# EAGLE design Adafruit_LSM6DSOX (EAGLE 9.5.1)
COMPANY: ADAFRUIT INDUSTRIES; DRAWN: KTOWN; REV: A
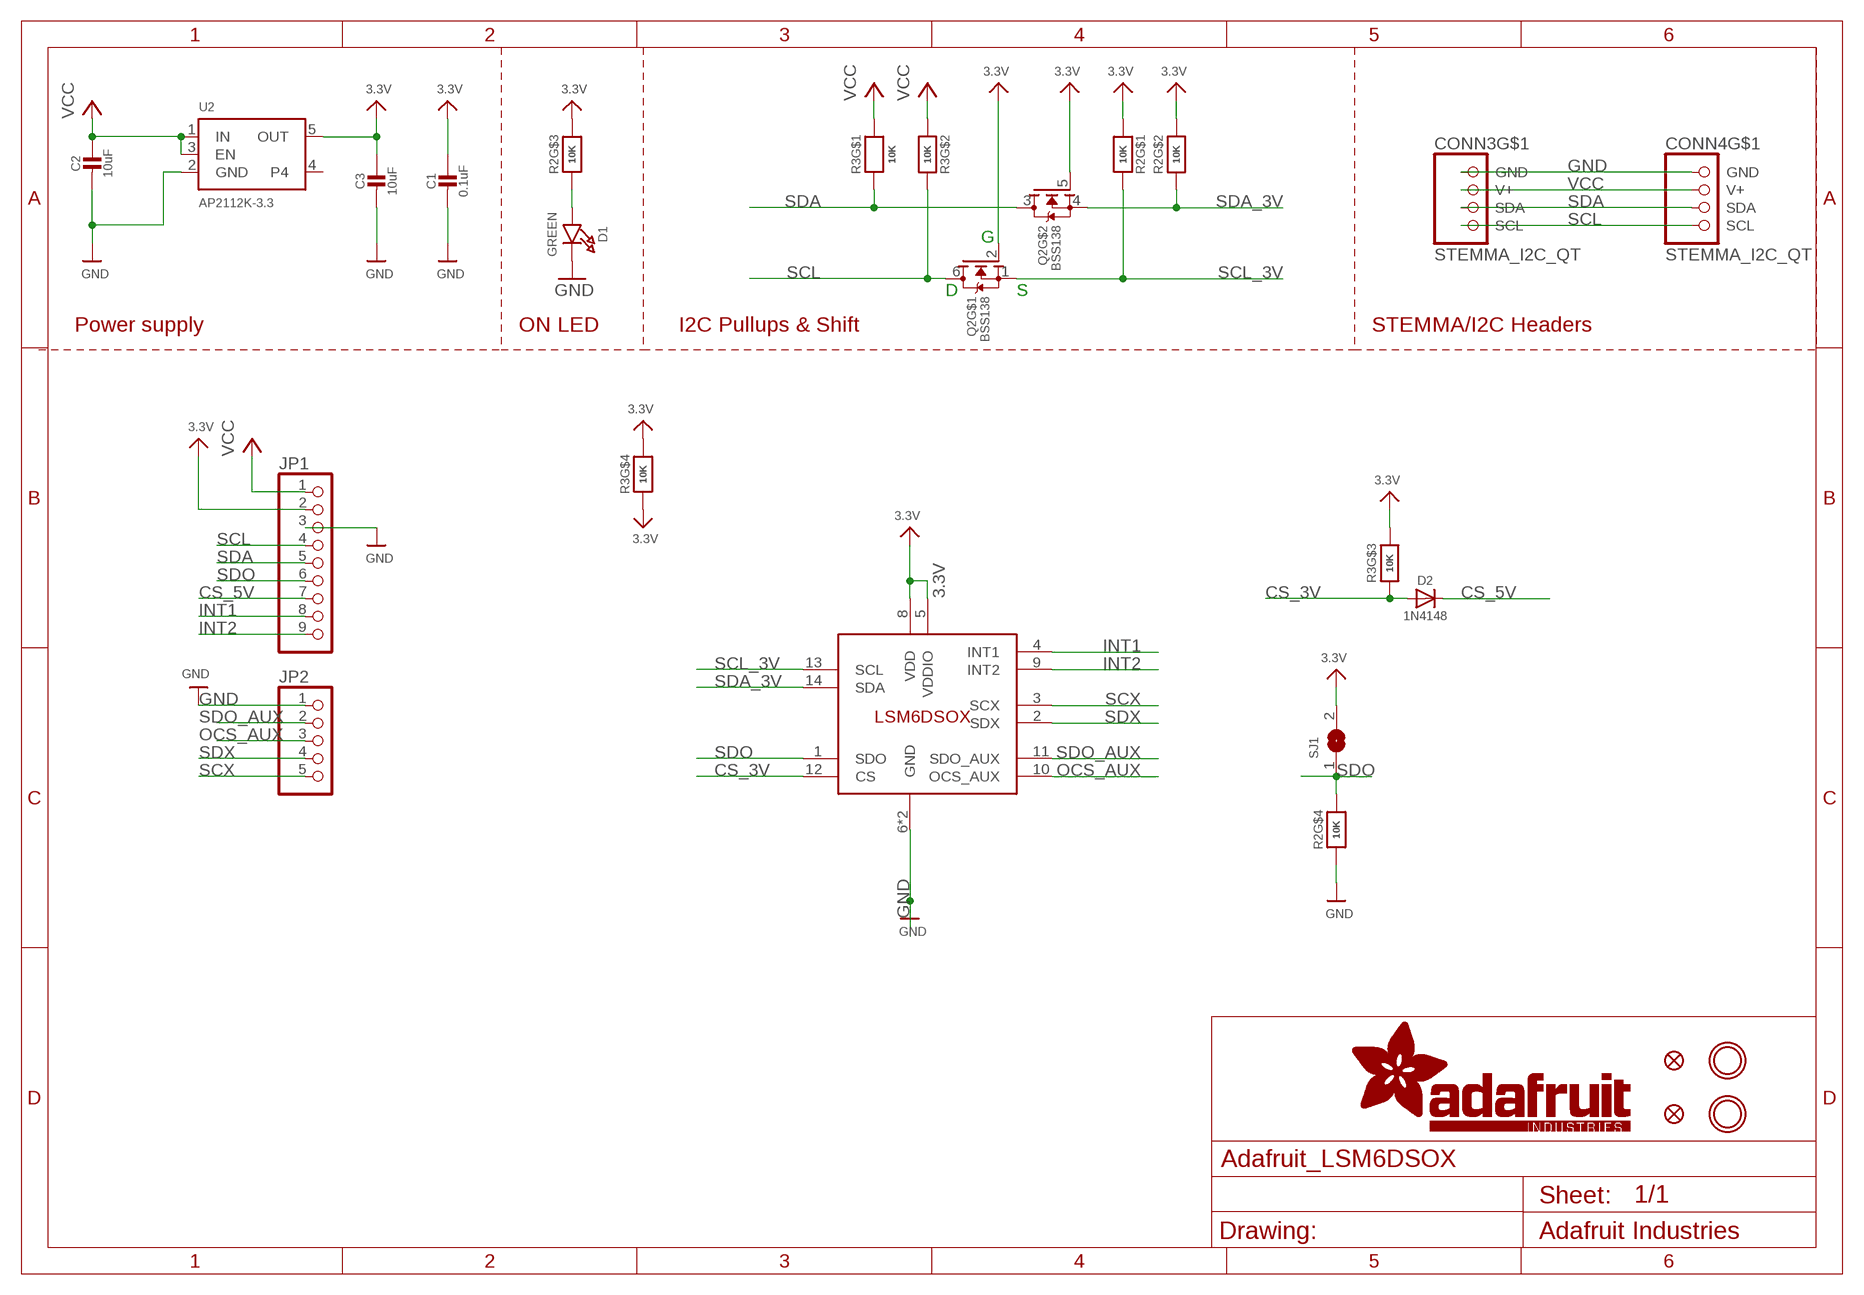
[diagram p0: schematic, sheet 1]

## Parts
C1  0.1uF  CAP_CERAMIC0603_NO  [0603-NO]
C2  10uF  CAP_CERAMIC0805-NOOUTLINE  [0805-NO]
C3  10uF  CAP_CERAMIC0805-NOOUTLINE  [0805-NO]
CONN3  STEMMA_I2C_QT  [JST_SH4]
CONN4  STEMMA_I2C_QT  [JST_SH4]
D1  GREEN  LED0603_NOOUTLINE  [CHIPLED_0603_NOOUTLINE]
D2  1N4148  DIODESOD-323  [SOD-323]
FID3  FIDUCIAL_1MM  [FIDUCIAL_1MM]
FID4  FIDUCIAL_1MM  [FIDUCIAL_1MM]
JP1  HEADER-1X970MIL  [1X09_ROUND_70]
JP2  HEADER-1X570MIL  [1X05_ROUND_70]
Q2  BSS138  MOSFET-N_DUAL  [SOT363]
R2  10K  RESISTOR_4PACK  [RESPACK_4X0603]
R3  10K  RESISTOR_4PACK  [RESPACK_4X0603]
SJ1  SOLDERJUMPER  [SOLDERJUMPER_ARROW_NOPASTE]
U2  AP2112K-3.3  VREG_SOT23-5  [SOT23-5]
U$1  MOUNTINGHOLE2.5  [MOUNTINGHOLE_2.5_PLATED]
U$2  LSM6DSOX  [LGA-14L]
U$17  MOUNTINGHOLE2.5  [MOUNTINGHOLE_2.5_PLATED]

## Nets
3.3V [lowpower]: C1.1 C3.1 JP1.2 Q2.2(G) Q2.5(G) R2.1 R2.2 R2.6 R3.3 R3.4 R3.5 SJ1.2 U2.5(OUT) U$2.5(VDDIO) U$2.8(VDD)
CS_3V: D2.A R3.6 U$2.12(CS)
CS_5V: D2.C JP1.7
GND [highpower]: C1.2 C2.2 C3.2 CONN3.1(GND) CONN4.1(GND) D1.C JP1.3 JP2.1 R2.4 U2.2(GND) U$2.6(GND) U$2.7(GND)
INT1: JP1.8 U$2.4(INT1)
INT2: JP1.9 U$2.9(INT2)
N$1: D1.A R2.3
OCS_AUX: JP2.3 U$2.10(OCS_AUX)
SCL: CONN3.4(SCL) CONN4.4(SCL) JP1.4 Q2.6(D) R3.2
SCL_3V: Q2.1(S) R2.8 U$2.13(SCL)
SCX: JP2.5 U$2.3(SCX)
SDA: CONN3.3(SDA) CONN4.3(SDA) JP1.5 Q2.3(D) R3.1
SDA_3V: Q2.4(S) R2.7 U$2.14(SDA)
SDO: JP1.6 R2.5 SJ1.1 U$2.1(SDO)
SDO_AUX: JP2.2 U$2.11(SDO_AUX)
SDX: JP2.4 U$2.2(SDX)
VCC [highpower]: C2.1 CONN3.2(V+) CONN4.2(V+) JP1.1 R3.7 R3.8 U2.1(IN) U2.3(EN)
Unconnected: CONN3.MT1(MT) CONN3.MT2(MT) CONN4.MT1(MT) CONN4.MT2(MT) U2.4

## Notes on the sheet
- G
- D | S
- Power supply | ON LED | I2C Pullups & Shift | STEMMA/I2C Headers

## Library data of the parts
C1-C3 = microbuilder:CAP_CERAMIC: Ceramic Capacitors For new designs, use the packages preceded by an '_' character since they are more reliable: The following footprints should be used on most boards: _0402 - Standard footprint for regular board layouts _0603 - Standard footprint for regular board layouts _0805 - Standard footprint for regular board layouts _1206 - Standard footprint for regular board layouts For extremely tight-pitch boards where space is at a premium, the following 'micro-pitch' footprints can be used (smaller pads, no silkscreen outline, etc.): _0402MP - Micro-pitch footprint for very dense/compact boards _0603MP - Micro-pitch footprint for very dense/compact boards _0805MP - Micro-pitch footprint for very dense/compact boards _1206MP - Micro-pitch footprint for very dense/compact boards
CONN3 CONN4 = microbuilder:STEMMA_I2C
D1 = microbuilder:LED: LED 0603 - 0603 Surface Mount Package 2mA: Green LED - Low Power (3.9mcd, 2ma, 1.7Vf) - Digikey: 475-2709-2-ND Orange LED - Low Power (9.8mcd, 2ma, 1.8Vf) - Digikey: 475-1194-2-ND Red LED - Low Power (5mcd, 2ma, 1.8Vf) - Digikey: 475-1195-2-ND Yellow LED - Low Power (7mcd, 2ma, 1.8Vf) - Digikey: 475-1196-2-ND 5mA: Blue LED - Low Power (17mcd, 5ma, 2.9Vf) - Digikey: LNJ937W8CRACT-ND 0805 - 0805 Surface Mount Package 2mA: Red LED (8.8mcd, 2mA, 1.8Vf, Clear) - Low Power [Digikey: 475-2510-1-ND] Green LED (5mcd, 2mA, 1.8Vf, Clear) - Low Power [Digikey: 475-2730-1-ND] Yellow LED (11.3mcd, 2mA, 1.8Vf, Clear) - Low Power [Digikey: 475-2555-1-ND] 20mA: Red LED (104mcd, 20mA, Diffused) - LS R976 [Digikey: 475-1278-6-ND] Red LED (12mcd, 20mA, 2.0Vf, Clear) - APT2012EC [Digikey: 754-1128-1-ND] Green LED (15mcd, 20mA, 2.2Vf, Clear) - APT2012GC [Digikey: 754-1131-1-ND] Orange LED (160mcd, 20mA, 2.1Vf, Clear) - APT2012SECK [Digikey: 754-1130-1-ND] 1206 - 1206 Surface Mount Package Green LED (26mcd, 20mA, Diffused) - LG N971 [Digikey: 475-1407-6-ND] Red LED (15mcd, 20mA, Diffused) - LH N974 [Digikey: 475-1416-6-ND] Cree - Cree High-Power Surface Mount LEDs XPEBWT-L1-0000-00D50 - White 111lm 350mA 2.9Vf 6200K 110° XTEAWT-00-0000-00000LEE3 - White 114lm 350mA 2.85Vf 5000K 115° Everlight - Everlight 45-21 Series Surface Mount LEDs 45-21/QK2C-B2832AC2CB2/2T - Warm White 2000mcd 20mA 3.25Vf 3050K 120° 45-21/LK2C-B38452C4CB2/2T - Nuetral White 2000mcd 20mA 3.25Vf 4150K 120° 45-21/LK2C-B50634C6CB2/2T - Cold White 2200mcd 20mA 3.25Vf 5650K 120° PLCC2 Reverse Mount LS T77K-J1L2-1-0-2-R18-Z - Red 11.25mcd 2mA 1.8Vf 630nm 120° LO T77K-L1M2-24-Z - Orange 19.6mcd 2mA 1.8Vf 606nm 120° LY T77K-K2M1-26-Z - Yellow 15.7mcd 2mA 1.8Vf 587nm 120°
D2 = microbuilder:DIODE: Diode SMA Model Volts Amps Type Vf Ir Digikey # Notes SSA34-E3 40V 3A Schottky 480mV @ 3A 200uA @ 40V SSA34-E3/61TGITR-ND CDBA120-G 20V 1A Schottky 500mV @ 1A 500uA @ 20V 641-1014-6-ND REEL MBRA210 10V 2A Schottky 350mV @ 2A 700uA @ 10V MBRA210LT3 SOD-123 Model Volts Amps Type Vf Ir Order # Notes BAT54T1G 30V 200mA Schottky 800mV @ 200mA 2uA @ 25V BAT54T1GOSTR-ND B0530W 30V 500mA Schottky 430mV @ 500mA 130uA @ 30V B0530W-FDICT-ND REEL MBR120 20V 1A Schottky 340mV @ 1A MBR120VLSFT1GOSCT-ND SOD-323 Model Volts Amps Type Vf Ir Order # Notes PMEG2005EJ 20V 500mA Schottky 355mV @ 500mA 568-4110-1-ND ZLLS410 10V 570mA Schottky 380mV @ 570mA ZLLS410CT-ND 1N4148WS 75V 150mA Silicon/Simple 1V 1N4148WSFSCT-ND REEL SOD-523 Model Volts Amps Type Vf Ir Order # Notes BAT54XV2 30V 200mA Schottky 0.8V @ 100mA BAT54XV2CT-ND TB751S 30V 30mA Schottky RB751S-40TE61CT-ND SOT23-R/W (R = Solder Paste/Reflow Ovens, W = Hand-Soldering) Model Volts Amps Type Vf Ir Order # Notes BAT54FILM 40V 300mA Schottky 497-7162-1-ND POWERDI-5 Model Volts Amps Type Vf Ir Order # Notes PDS560 60V 5A Schottky 670mV @ 5A 150uA @ 60V PDS560DICT-ND
FID3 FID4 = microbuilder:FIDUCIAL: Fiducial Alignment Points Various fiducial points for machine vision alignment.; BOM: EXCLUDE
JP1 = microbuilder:HEADER-1X9: PIN HEADER
JP2 = microbuilder:HEADER-1X5: PIN HEADER
Q2 = microbuilder:MOSFET-N_DUAL: Dual N-Channel MOSFET SOT363 (2.0x1.25mm) 2N7002PS - 60V, 320mA [Digikey: 568-5984-1-ND]
R2 R3 = microbuilder:RESISTOR_4PACK: Resistor Packs (4 resistors) 4 x 0603 10K 1/16W - Digikey: YC164J-10KCT-ND
SJ1 = microbuilder:SOLDERJUMPER: SMD Solder JUMPER Solder the two pads together to create a connection, or remove the solder to break it. REFLOW - Use this footprint for solder paste and reflow ovens. WAVE - Use this footprint for hand-soldering (larger pads). CLOSED - Has a trace between the two pads to ensure it is closed by default. The trace needs to be cut to disable the jumper, and can be closed again by creating a solder bridge between the two pads.; BOM: EXCLUDE
U2 = microbuilder:VREG_SOT23-5: SOT23-5 Fixed Voltage Regulators Part Current Out V Out V In V Dropout θJA (°C/W) TJ (°C) Digikey Part No. ADP121 150mA 3.3V 3.4-5.5V 0.09V @ 150mA -- -- ADP121-AUJZ33R7CT-ND ADP121 150mA 3.0V 3.1-5.5V 0.09V @ 150mA -- -- ADP121-AUJZ30R7CT-ND ADP122 300mA 3.3V 3.4-5.5V 0.085V @ 300mA -- -- ADP122AUJZ-3.3-R7CT-ND ADP1712 300mA 3.3V 3.5-5.5V 0.17V @ 300mA -- -- ADP1712AUJZ-3.3-R7TR-ND AP7311 (Low Cost) 150mA 3.3V 3.5-6V 0.15V @ 150mA -- -- AP7311-33WG-7DICT-ND LD39015M18R 150mA 1.8V 1.9V-5.5V 0.08V @ 100mA -- -- 497-6977-1-ND LP2985A-33DBVR 150mA 3.3V 3.3-16V 0.28V @ 150mA 206 150 296-18479-1-ND MCP1824T-3302E/OT 300mA 3.3V 3.5V-6V 0.2V @ 300mA -- -- MCP1824T-3302E/OTCT-ND MIC5205-2.5YM5 TR 150mA 2.5V 2.7-16V 0.165V @ 150mA -- -- 576-1257-2-ND MIC5205-3.0YM5 TR 150mA 3.0V 3.2V-16V 0.165V @ 150mA -- -- 576-1258-2-ND MIC5205-3.3YM5 TR 150mA 3.3V 3.5V-16V 0.165V @ 150mA -- -- 576-1259-2-ND TPS780330220 150mA 3.3V+2.2V 3.6-5.5V 250mV Max -- -- 296-23332-1-ND TDA3663/N1,135 100mA 3.3V 3.5-45V 0.18V @ 50mA -- -- 568-5343-1-ND Max operating temp can be calculated using θJA, TJ (max junction temperature), and power in watts. Set the "Maximum Ambient Temperature" until it reaches TJ ("Max Junction Temperature"), which is the absolute limit for safe use of the regulator: Heat Sink Temperature Calculator <http://www.daycounter.com/Calculators/Heat-Sink-Temperature-Calculator.phtml> For example, With 12V source into a 3.3V LP2985 and a 30mA load, we are dissipating (12V-3.3V) * 0.03A = 0.261W. With a θJA of 206 °C/W, a TJ of 150°C, and 261mW we can safely use the chip without a heat sink up to 75°C (=147.1°C Junction Temperature).
U$1 U$17 = microbuilder:MOUNTINGHOLE: Mounting Hole For #2 screws (0.086"/2.18mm width, 0.094"/2.4mm hole) use 2.5mm; BOM: EXCLUDE
U$2 = microbuilder:LSM6DSOX

## Net classes
1 highpower: width 0.406 mm, drill 0.483 mm
2 lowpower: width 0.305 mm, drill 0.483 mm

## Board
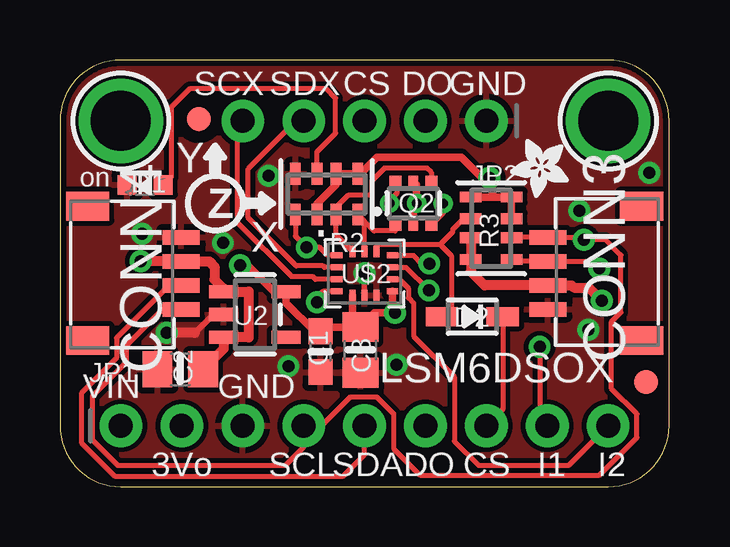
[diagram p1: board, top side]
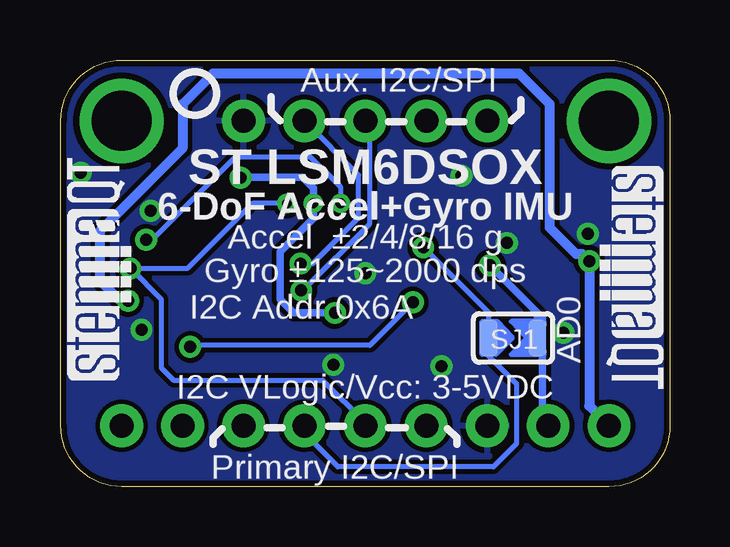
[diagram p2: board, bottom side, seen from below]

Size 25.4 x 17.78 mm. Coordinates in mm from the lower left corner, seen from the top.
Outline: 0,15.24 0,2.54 arc90 2.54,0 22.86,0 arc90 25.4,2.54 25.4,15.24 arc90 22.86,17.78 2.54,17.78 arc90 0,15.24
Copper layers (1*16): Top 0.035mm / dielectric 1.5mm / Bottom 0.035mm
Design rules "adafruit *": minimum track width 8mil, minimum drill 15.5mil, track to track 8mil, track to pad 8mil, pad to pad 8mil, via to via 8mil, smd to smd 8mil, copper to edge 10mil, drill to drill 8mil, minimum pad ring 10mil, minimum via ring 8mil, stop-mask expansion 2mil, vias tented up to drill 20mil, thermal gap 10mil

### Footprints (pad centres in the part's own frame; a part is rotated, then mirrored left to right if it is on the bottom)
0603-NO = smd 1.075 x 1: 1 -0.85,0; 2 0.85,0
0805-NO = smd 1.24 x 1.5: 1 -0.95,0; 2 0.95,0
JST_SH4 = smd 0.6 x 1.55: 1 -1.5,2.514; 2 -0.5,2.514; 3 0.5,2.514; 4 1.5,2.514 | smd 1.2 x 1.8: MT1 -2.8,-1.386; MT2 2.8,-1.386
CHIPLED_0603_NOOUTLINE = smd 0.8 x 0.8: A 0,-0.75; C 0,0.75
SOD-323 = smd 1.35 x 0.8: A 1.27,0; C -1.27,0
FIDUCIAL_1MM = smd 1 x 1: 1 0,0
1X09_ROUND_70 = drill 1 pad 1.778: 1 -10.16,0; 2 -7.62,0; 3 -5.08,0; 4 -2.54,0; 5 0,0; 6 2.54,0; 7 5.08,0; 8 7.62,0; 9 10.16,0
1X05_ROUND_70 = drill 1 pad 1.778: 1 -5.08,0; 2 -2.54,0; 3 0,0; 4 2.54,0; 5 5.08,0
SOT363 = smd 0.5 x 0.5: 1 -0.75,-0.9; 3 0.75,-0.9; 4 0.75,0.9; 6 -0.75,0.9 | smd 0.4 x 0.5: 2 0,-0.9; 5 0,0.9
RESPACK_4X0603 = smd 0.45 x 0.9: 1 -1.3,-0.85; 2 -0.4,-0.85; 3 0.4,-0.85; 4 1.3,-0.85; 5 1.3,0.85; 6 0.4,0.85; 7 -0.4,0.85; 8 -1.3,0.85
SOLDERJUMPER_ARROW_NOPASTE = smd 0.762 x 1.524: 1 -1.016,0; 2 1.016,0
SOT23-5 = smd 0.55 x 1.2: 1 -0.95,-1.3; 2 0,-1.3; 3 0.95,-1.3; 4 0.95,1.3; 5 -0.95,1.3
MOUNTINGHOLE_2.5_PLATED = drill 2.5 pad 3.2: P$1 0,0
LGA-14L = smd 0.475 x 0.25: 1 -1.163,0.75; 2 -1.163,0.25; 3 -1.163,-0.25; 4 -1.163,-0.75; 8 1.163,-0.75; 9 1.163,-0.25; 10 1.163,0.25; 11 1.163,0.75 | smd 0.25 x 0.475: 5 -0.5,-0.912; 6 0,-0.912; 7 0.5,-0.912; 12 0.5,0.912; 13 0,0.912; 14 -0.5,0.912

### Placement (x,y rotation side)
C1  10.86,5.63 270 top
C2  5.02,4.89 180 top
C3  12.52,5.7 270 top
CONN3  22.86,8.89 90 top
CONN4  2.54,8.89 270 top
D1  3.56,12.57 90 top
D2  17.2,7.09 180 top
FID3  5.79,15.32 0 top
FID4  24.43,4.37 0 top
JP1  12.7,2.54 0 top
JP2  12.7,15.24 180 top
Q2  14.73,11.81 0 top
R2  11.11,12.19 180 top
R3  17.98,10.77 90 top
SJ1  6.54,6.2 0 bottom
U2  8.13,7.18 270 top
U$1  2.54,15.24 0 top
U$2  12.7,8.89 0 top
U$9  [ADAFRUIT_2.5MM]  21.21,14.48 180 top
U$17  22.86,15.24 0 top
U$25  [PCBFEAT-REV-040]  19.81,16.38 0 bottom
U$30  [STEMMAQT]  22.48,4.45 90 bottom
U$31  [STEMMAQT]  2.92,13.34 270 bottom

### Tracks (layer width: path | path; a pad name or v marks a point on that pad's centre or on a via)
3.3V  (via drill 0.4, 0.5)
  Top 0.305: U$2.5 12.2,6.97 C3.1 | Q2.5 14.87,12.57 v14.87,11.81 14.73,11.68 Q2.2 | v7.51,9.23 7.82,9.23 8.93,8.13 U2.5 9.43,7.65 10.61,6.48 C1.1 11.04,6.65 C3.1 | R2.6 10.71,11.79 11.51,12.59 R2.2 R2.1 12.54,13.04 13.23,13.73 16.73,13.73 17.59,12.87 v17.91,12.87 18.03,12.75 18.03,12.07 | R3.3 R3.4 | R3.4 | R3.5 18.03,12.07 | 18.03,12.07 R3.4 | C3.1 13.11,7.24 13.78,7.24 | 13.78,7.24 v13.97,7.24 | U$2.8 13.86,7.32 13.78,7.24
  Bottom 0.305: JP1.2 5.32,2.78 5.32,7.04 v7.51,9.23 5.52,7.25 SJ1.2 | v13.97,7.24 15.68,7.24 16.26,7.81 16.26,9.79 14.87,11.18 v14.87,11.81 14.87,12.45 15.31,12.89 17.89,12.89 v17.91,12.87
CS_3V
  Top 0.203: U$2.12 13.2,10.03 13.27,10.1 15.85,10.1 | 15.85,10.1 16.32,9.63 16.32,7.48 D2.A | 15.85,10.1 15.86,10.1 16.38,10.62 16.38,10.72 16.83,11.17 R3.6
CS_5V
  Top 0.203: JP1.7 18.47,3.23 D2.C
GND  (via drill 0.5)
  Top 0.203: U$2.6 v12.7,8.89
  Top 0.254: 6.75,7.1 6.31,7.1 5.63,6.41
  Top 0.406: U2.2 6.75,7.1 | 5.63,6.41 v4.45,6.41
  other vias: 3.43,10.54 21.65,11.49 22.03,6.54 24.57,13.08 6.79,10.16 8.7,12.95 14.03,5.08 9.53,5.02
  pour Top: 0,17.78 25.4,17.78 25.4,0 0,0
  pour Bottom: 0,17.78 25.4,17.78 25.4,0 0,0
INT1  (via drill 0.5)
  Top 0.203: U$2.4 10.97,8.14 10.72,7.89 v10.72,7.68 | v20,5.83 20,2.86 JP1.8
  Bottom 0.203: v10.72,7.68 12.51,5.89 19.94,5.89 v20,5.83
INT2
  Top 0.203: JP1.9 21.21,0.89 17.46,0.89 16.45,1.91 16.45,4.57 14.74,6.27 14.74,7.65 14.52,7.87 14.52,8.27 14.16,8.64 U$2.9
N$1
  Top 0.203: D1.A 4.64,12.9 4.64,15.81 5.4,16.57 11.11,16.57 11.49,16.19 11.49,14.73 10.71,13.95 R2.3
OCS_AUX  (via drill 0.5)
  Top 0.203: U$2.10 14.41,9.14 v15.38,8.18
  Bottom 0.203: v15.38,8.18 15.3,8.18 12.51,10.97 12.51,15.05 JP2.3
SCL  (via drill 0.4, 0.5)
  Top 0.203: Q2.6 14.05,12.65 14.05,12.22 13.74,11.91 v13.74,11.81 | CONN4.4 4.28,7.39 2.77,5.88 2.77,5.2 1.35,3.78 1.35,1.96 2.42,0.89 9.4,0.89 10.16,1.65 JP1.4 10.92,2.54 12.12,3.75 13.21,3.75 13.91,3.05 13.91,1.59 15.01,0.48 22.49,0.48 24.05,2.05 24.05,3.03 23,4.09 23,6.87 23.39,7.26 23.39,9.65 22.76,10.29 v21.84,10.29 21.74,10.39 CONN3.4 18.85,10.39 R3.2
  Bottom 0.203: v21.84,10.29 21.59,10.29 18.12,13.76 15.01,13.76 13.74,12.49 v13.74,11.81
SCL_3V
  Top 0.203: 13.98,10.66 13.1,10.66 R2.8 12.7,11.05 U$2.13 | Q2.1 13.98,10.66 | 13.98,10.66
SCX
  Top 0.203: U$2.3 10.65,8.64 10.52,8.77 9.65,8.77 7.39,11.02 7.39,14.93 7.62,15.16 JP2.5
SDA  (via drill 0.4, 0.5)
  Top 0.203: R3.1 18.91,9.39 CONN3.3 22.49,9.39 v22.49,9.09 | Q2.3 15.97,11.4 v15.97,11.8 | CONN4.3 4.55,8.39 2.36,6.2 2.36,5.36 0.89,3.89 0.89,1.84 2.29,0.45 11.81,0.45 12.7,1.33 JP1.5
  Bottom 0.203: v15.97,11.8 17.41,11.8 20.12,9.09 v22.49,9.09 21.21,7.81 21.21,4.95 20.7,4.45 14.48,4.45 12.7,2.67 JP1.5
SDA_3V
  Top 0.203: Q2.4 15.48,13.09 15.3,13.27 13.53,13.27 13.01,12.75 13.01,12.16 12.03,12.16 11.51,11.64 R2.7 11.51,10.49 U$2.14
SDO  (via drill 0.5)
  Top 0.203: U$2.1 11.16,9.64 10.83,9.97 v10.29,9.97 9.81,10.44 R2.5
  Bottom 0.203: JP1.6 15.24,2.22 13.84,0.83 7.37,0.83 6.39,1.8 6.39,4.27 7.56,5.44 SJ1.1 7.56,7.24 v10.29,9.97
SDO_AUX  (via drill 0.5)
  Top 0.203: v15.4,9.3 15.08,9.3 14.75,9.63 13.88,9.63 U$2.11
  Bottom 0.203: v15.4,9.3 14.9,9.3 12.98,11.21 12.98,12.98 JP2.2
SDX
  Top 0.203: U$2.2 11.03,9.14 10.97,9.2 9.85,9.2 7.85,11.2 7.85,13.24 9.85,15.24 JP2.4
VCC  (via drill 0.5)
  Top 0.406: R3.7 R3.8 17.13,8.96 17.7,8.39 CONN3.2 21.33,8.39 21.43,8.29 22.05,8.29 v22.59,7.75 | C2.1 6.83,5.75 U2.3 7.87,6.23 7.87,8.13 U2.1 6.83,8.25 6.45,8.63 6.45,9.17 6.23,9.39 CONN4.2 v3.37,9.39 v3.37,9.4
  Bottom 0.406: JP1.1 3.37,3.37 v3.37,9.4 3.66,9.69 3.91,9.69 5.02,10.8 5.02,15.94 6.29,17.21 19.05,17.21 20.32,15.94 20.32,14.1 23.75,10.67 23.75,8.57 22.92,7.75 v22.59,7.75

### Text on the board
tPlace: SCX | SDX | CS | DO | GND | on | Y | Z | X | LSM6DSOX | VIN | GND | 3Vo | SCL | SDA | DO | CS | I1 | I2
bPlace: Aux. I2C/SPI | ST LSM6DSOX | 6-DoF Accel+Gyro IMU | Accel ±2/4/8/16 g | Gyro ±125~2000 dps | AD0 | I2C Addr 0x6A | I2C VLogic/Vcc: 3-5VDC | Primary I2C/SPI